# Altium schematic sheet AlpLogo.SchDoc
size A3; Author: ALP Electronics; CompanyName: ALP Electronics; DrawnBy: Caner Alp; Engineer: Caner Alp; Organization: ALP Electronics; Address2: Västerås; Address4: Sweden; SheetNumber: 1; SheetTotal: 1
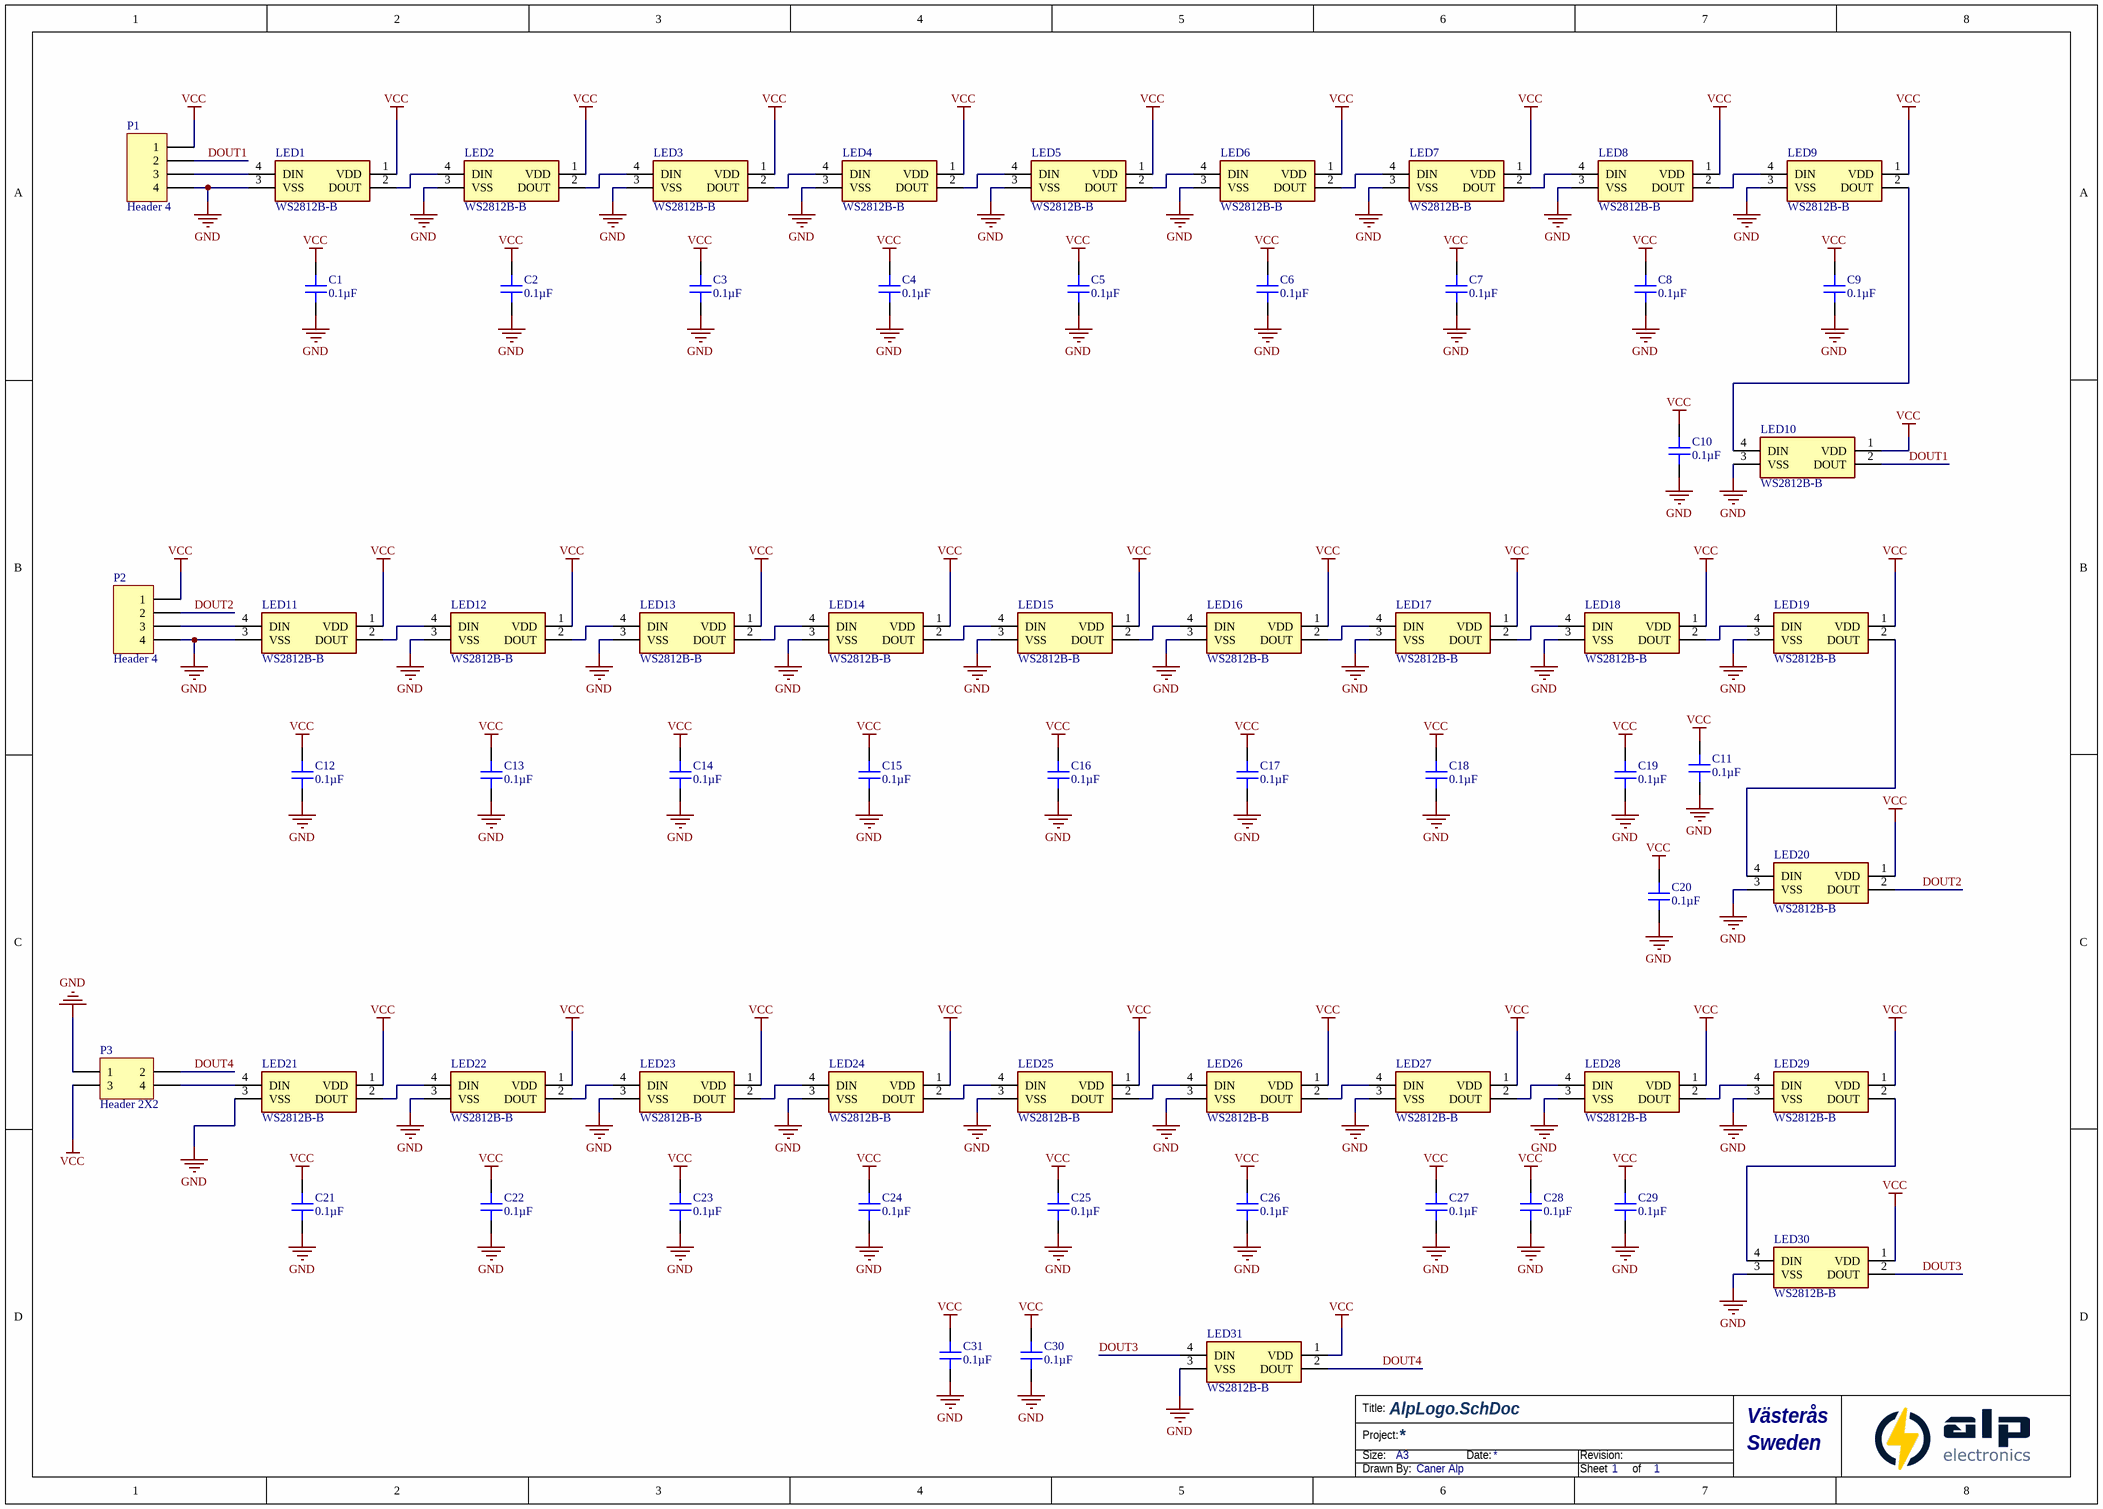
[diagram p0: AlpLogo.SchDoc]

## Parts
C1  0.1µF  [CAP 0805_2012]
C2  0.1µF  [CAP 0805_2012]
C3  0.1µF  [CAP 0805_2012]
C4  0.1µF  [CAP 0805_2012]
C5  0.1µF  [CAP 0805_2012]
C6  0.1µF  [CAP 0805_2012]
C7  0.1µF  [CAP 0805_2012]
C8  0.1µF  [CAP 0805_2012]
C9  0.1µF  [CAP 0805_2012]
C10  0.1µF  [CAP 0805_2012]
C11  0.1µF  [CAP 0805_2012]
C12  0.1µF  [CAP 0805_2012]
C13  0.1µF  [CAP 0805_2012]
C14  0.1µF  [CAP 0805_2012]
C15  0.1µF  [CAP 0805_2012]
C16  0.1µF  [CAP 0805_2012]
C17  0.1µF  [CAP 0805_2012]
C18  0.1µF  [CAP 0805_2012]
C19  0.1µF  [CAP 0805_2012]
C20  0.1µF  [CAP 0805_2012]
C21  0.1µF  [CAP 0805_2012]
C22  0.1µF  [CAP 0805_2012]
C23  0.1µF  [CAP 0805_2012]
C24  0.1µF  [CAP 0805_2012]
C25  0.1µF  [CAP 0805_2012]
C26  0.1µF  [CAP 0805_2012]
C27  0.1µF  [CAP 0805_2012]
C28  0.1µF  [CAP 0805_2012]
C29  0.1µF  [CAP 0805_2012]
C30  0.1µF  [CAP 0805_2012]
C31  0.1µF  [CAP 0805_2012]
LED1  WS2812B-B  [WS2812BB]
LED2  WS2812B-B  [WS2812BB]
LED3  WS2812B-B  [WS2812BB]
LED4  WS2812B-B  [WS2812BB]
LED5  WS2812B-B  [WS2812BB]
LED6  WS2812B-B  [WS2812BB]
LED7  WS2812B-B  [WS2812BB]
LED8  WS2812B-B  [WS2812BB]
LED9  WS2812B-B  [WS2812BB]
LED10  WS2812B-B  [WS2812BB]
LED11  WS2812B-B  [WS2812BB]
LED12  WS2812B-B  [WS2812BB]
LED13  WS2812B-B  [WS2812BB]
LED14  WS2812B-B  [WS2812BB]
LED15  WS2812B-B  [WS2812BB]
LED16  WS2812B-B  [WS2812BB]
LED17  WS2812B-B  [WS2812BB]
LED18  WS2812B-B  [WS2812BB]
LED19  WS2812B-B  [WS2812BB]
LED20  WS2812B-B  [WS2812BB]
LED21  WS2812B-B  [WS2812BB]
LED22  WS2812B-B  [WS2812BB]
LED23  WS2812B-B  [WS2812BB]
LED24  WS2812B-B  [WS2812BB]
LED25  WS2812B-B  [WS2812BB]
LED26  WS2812B-B  [WS2812BB]
LED27  WS2812B-B  [WS2812BB]
LED28  WS2812B-B  [WS2812BB]
LED29  WS2812B-B  [WS2812BB]
LED30  WS2812B-B  [WS2812BB]
LED31  WS2812B-B  [WS2812BB]
P1  Header 4  [HDR1X4]
P2  Header 4  [HDR1X4]
P3  Header 2X2  [HDR2X2]

## Nets
GND: C1.1 C2.1 C3.1 C4.1 C5.1 C6.1 C7.1 C8.1 C9.1 C10.1 C11.1 C12.1 C13.1 C14.1 C15.1 C16.1 C17.1 C18.1 C19.1 C20.1 C21.1 C22.1 C23.1 C24.1 C25.1 C26.1 C27.1 C28.1 C29.1 C30.1 C31.1 LED1.3(VSS) LED2.3(VSS) LED3.3(VSS) LED4.3(VSS) LED5.3(VSS) LED6.3(VSS) LED7.3(VSS) LED8.3(VSS) LED9.3(VSS) LED10.3(VSS) LED11.3(VSS) LED12.3(VSS) LED13.3(VSS) LED14.3(VSS) LED15.3(VSS) LED16.3(VSS) LED17.3(VSS) LED18.3(VSS) LED19.3(VSS) LED20.3(VSS) LED21.3(VSS) LED22.3(VSS) LED23.3(VSS) LED24.3(VSS) LED25.3(VSS) LED26.3(VSS) LED27.3(VSS) LED28.3(VSS) LED29.3(VSS) LED30.3(VSS) LED31.3(VSS) P1.4 P2.4 P3.1
VCC: C1.2 C2.2 C3.2 C4.2 C5.2 C6.2 C7.2 C8.2 C9.2 C10.2 C11.2 C12.2 C13.2 C14.2 C15.2 C16.2 C17.2 C18.2 C19.2 C20.2 C21.2 C22.2 C23.2 C24.2 C25.2 C26.2 C27.2 C28.2 C29.2 C30.2 C31.2 LED1.1(VDD) LED2.1(VDD) LED3.1(VDD) LED4.1(VDD) LED5.1(VDD) LED6.1(VDD) LED7.1(VDD) LED8.1(VDD) LED9.1(VDD) LED10.1(VDD) LED11.1(VDD) LED12.1(VDD) LED13.1(VDD) LED14.1(VDD) LED15.1(VDD) LED16.1(VDD) LED17.1(VDD) LED18.1(VDD) LED19.1(VDD) LED20.1(VDD) LED21.1(VDD) LED22.1(VDD) LED23.1(VDD) LED24.1(VDD) LED25.1(VDD) LED26.1(VDD) LED27.1(VDD) LED28.1(VDD) LED29.1(VDD) LED30.1(VDD) LED31.1(VDD) P1.1 P2.1 P3.3
DOUT1: LED10.2(DOUT) P1.2
DOUT2: LED20.2(DOUT) P2.2
DOUT3: LED30.2(DOUT) LED31.4(DIN)
DOUT4: LED31.2(DOUT) P3.2
NetLED1_2: LED1.2(DOUT) LED2.4(DIN)
NetLED1_4: LED1.4(DIN) P1.3
NetLED2_2: LED2.2(DOUT) LED3.4(DIN)
NetLED3_2: LED3.2(DOUT) LED4.4(DIN)
NetLED4_2: LED4.2(DOUT) LED5.4(DIN)
NetLED5_2: LED5.2(DOUT) LED6.4(DIN)
NetLED6_2: LED6.2(DOUT) LED7.4(DIN)
NetLED7_2: LED7.2(DOUT) LED8.4(DIN)
NetLED8_2: LED8.2(DOUT) LED9.4(DIN)
NetLED9_2: LED9.2(DOUT) LED10.4(DIN)
NetLED11_2: LED11.2(DOUT) LED12.4(DIN)
NetLED11_4: LED11.4(DIN) P2.3
NetLED12_2: LED12.2(DOUT) LED13.4(DIN)
NetLED13_2: LED13.2(DOUT) LED14.4(DIN)
NetLED14_2: LED14.2(DOUT) LED15.4(DIN)
NetLED15_2: LED15.2(DOUT) LED16.4(DIN)
NetLED16_2: LED16.2(DOUT) LED17.4(DIN)
NetLED17_2: LED17.2(DOUT) LED18.4(DIN)
NetLED18_2: LED18.2(DOUT) LED19.4(DIN)
NetLED19_2: LED19.2(DOUT) LED20.4(DIN)
NetLED21_2: LED21.2(DOUT) LED22.4(DIN)
NetLED21_4: LED21.4(DIN) P3.4
NetLED22_2: LED22.2(DOUT) LED23.4(DIN)
NetLED23_2: LED23.2(DOUT) LED24.4(DIN)
NetLED24_2: LED24.2(DOUT) LED25.4(DIN)
NetLED25_2: LED25.2(DOUT) LED26.4(DIN)
NetLED26_2: LED26.2(DOUT) LED27.4(DIN)
NetLED27_2: LED27.2(DOUT) LED28.4(DIN)
NetLED28_2: LED28.2(DOUT) LED29.4(DIN)
NetLED29_2: LED29.2(DOUT) LED30.4(DIN)

## Notes on the sheet
- Title:
- Size:
- Project:
- A3
- Date:
- Revision:
- Drawn By:
- Sheet
- of

## Library data of the parts
C1-C31 = CC0805MRX7R9BB104: CAP CER 0.1UF 50V X7R 0805; Manufacturer: Yageo; Tolerance: ±20%; Part Number: CC0805MRX7R9BB104; Value: 0.1µF; Applications: General Purpose; Capacitance: 0.1µF; ComponentLink1Description: Datasheet; ComponentLink1URL: https://www.yageo.com/upload/media/product/productsearch/datasheet/mlcc/UPY-GPHC_X7R_6.3V-to-50V_18.pdf; ComponentLink2Description: DigiKey Link; ComponentLink2URL: http://digikey.com/product-detail/en/yageo/CC0805MRX7R9BB104/311-4351-1-ND/8025440; Device Package: 0805 (2012 Metric); LastUpdated: 2020-09-02 01:04:42; Lifecycle Status: Active; Minimum Order: 1; Mounting Type: Surface Mount, MLCC; Operating Temperature: -55°C ~ 125°C; Package / Case: 0805 (2012 Metric); Packaging: TapeAndReel; PartId: 2475; Part Status: Active; Price: 0.02; Series: CC; Size / Dimension: 0.079" L x 0.049" W (2.00mm x 1.25mm); Supplier 1: DigiKey; Supplier Part Number 1: 311-4351-1-ND; Temperature Coefficient: X7R; Thickness (Max): 0.037" (0.95mm); Voltage - Rated: 50V
LED1-LED31 = WS2812B-B: LED; Manufacturer_Name: Worldsemi; Datasheet Link: http://www.world-semi.com/DownLoadFile/111; Height: 1.62mm; Manufacturer_Part_Number: WS2812B-B
P1 P2 = Header 4: Header, 4-Pin; LatestRevisionDate: 17-Jul-2002; LatestRevisionNote: Re-released for DXP Platform.; Publisher: Altium Limited
P3 = Header 2X2: Header, 2-Pin, Dual row; LatestRevisionDate: 17-Jul-2002; LatestRevisionNote: Re-released for DXP Platform.; Publisher: Altium Limited